# Altium schematic sheet SK6812 Mini-E.SchDoc
size 127 x 127 mm
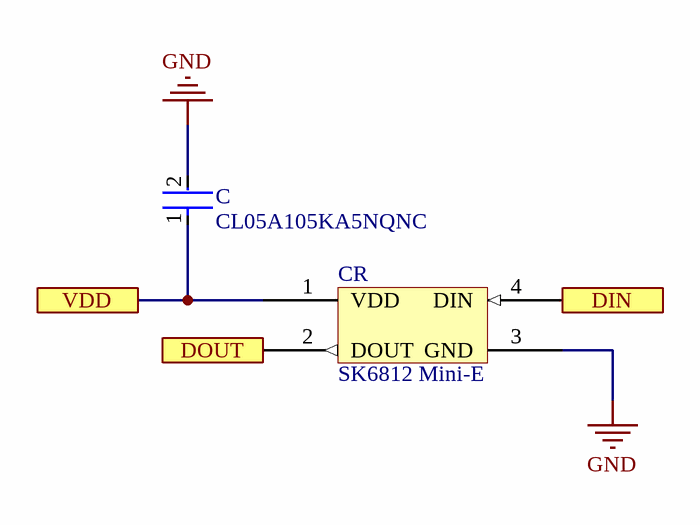
[diagram p0: SK6812 Mini-E.SchDoc]

## Parts
C  CL05A105KA5NQNC  [FP-CL542-IPC_C]
CR  SK6812 Mini-E  [SK6812 Mini-E]

## Ports
DIN (in), DOUT (out), VDD

## Nets
GND: C.2 CR.3(GND)
DIN: CR.4(DIN) ; port DIN
DOUT: CR.2(DOUT) ; port DOUT
VDD: C.1 CR.1(VDD) ; port VDD

## Library data of the parts
C = CMP-13271-001051-1: Cap Ceramic 1uF 25V X5R ±10% SMD 0402 +85°C Paper T/R; Radiation Hardening: No; Lead Free: Lead Free; Capacitance: 1uF; Package Quantity: 10000; Max Operating Temperature: 85°C; Voltage Rating: 25V; Case/Package: 0402; Min Operating Temperature: -55°C; Packaging: Tape and Reel; Tolerance: 10%; Height: 0.5mm; Thickness: 0.022inch; Case Code (Metric): 1005; Width: 0.02inch; Case Code (Imperial): 0402; Dielectric: X5R; Length: 1mm; Mount: Surface Mount; Material: Ceramic; Depth: 0.5mm
CR = SK6812 Mini-E: Individually Adressable SK6812 Mini-E 3528 LED